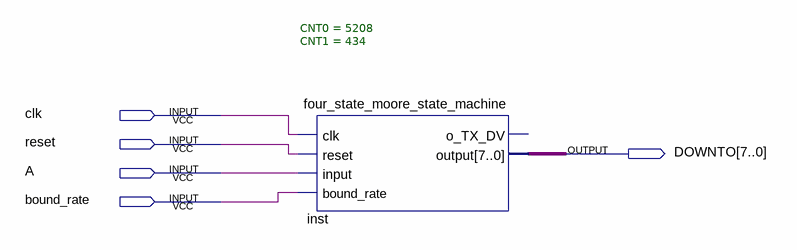
[diagram p0: schematic sheet]
// Quartus schematic uart_test01.bdf as structural Verilog: 1 symbols, 5 pins
module uart_test01 (
  input  clk,
  input  reset,
  input  A,
  input  bound_rate,
  output [7:0] DOWNTO
);

  four_state_moore_state_machine #(.CNT0(5208), .CNT1(434)) inst (
    .clk(clk), .reset(reset), .\input (A), .bound_rate(bound_rate), .\output (DOWNTO));  // open: o_TX_DV
endmodule
